# Altium schematic sheet 26D_STEPPER_test.SchDoc
size A4
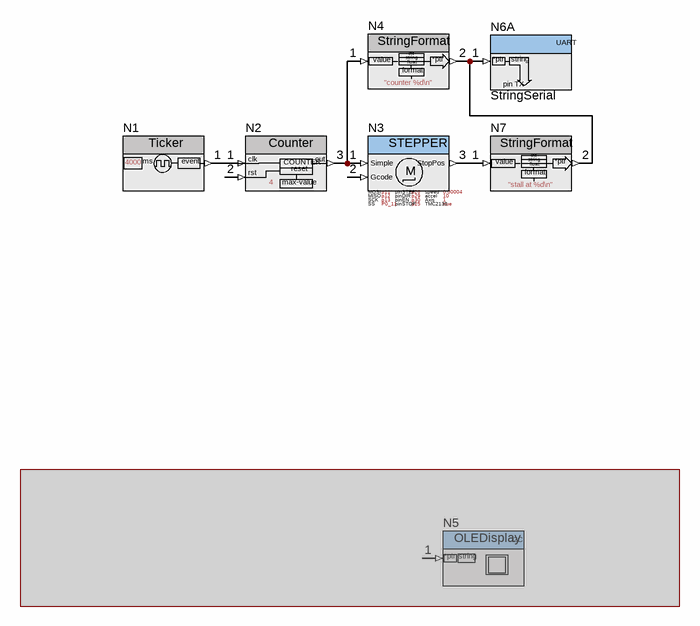
[diagram p0: 26D_STEPPER_test.SchDoc]

## Parts
N1  Ticker  nBlocksParameter1: 4000
N2  Counter  nBlocksParameter1: 4
N3  STEPPER  nBlocksParameter7: p30  nBlocksParameter8: p25  nBlocksParameter9: 0.00004  nBlocksParameter10: 10  nBlocksParameter11: 1  nBlocksParameter12: true  Parameter 12: TMC2130  Parameter 11: Axis  Parameter 10: accel  Parameter 9: speed  Parameter 8: pinSTOP  Parameter 7: pinEN  nBlocksParameter1: p11  nBlocksParameter2: p12  nBlocksParameter3: p13  nBlocksParameter4: P0_11  nBlocksParameter5: p26  nBlocksParameter6: p29  Parameter 6: pinDIR  Parameter 5: pinSTEP  Parameter 2: MISO  Parameter 1: MOSI  Parameter 4: SS  Parameter 3: SCK
N4  StringFormat  nBlocksParameter1: "counter %d\n"
N5  OLEDisplay  (masked out: inside a compile mask, not in the netlist)
N6  StringSerial  (part A of 2)
N7  StringFormat  nBlocksParameter1: "stall at %d\n"

## Nets
NetN1_1: N1.1(OUT) N2.1(COUNT-IN)
NetN2_3: N2.3(OUT) N3.1(Simple) N4.1(IN)
NetN3_3: N3.3(StopPos) N7.1(IN)
NetN4_2: N4.2(OUT) N6.1(TX) N7.2(OUT)

Not connected (* = marked no-connect by the designer): N2 2(RESET); N3 2(Gcode)

## Notes on the sheet
- (in symbol NODE-COUNTER) clk; out; COUNTER; rst; reset; max-value
- (in symbol NODE-OLEDisplay) I2C; *ptr; string
- (in symbol NODE-STEPPER) M
- (in symbol NODE-STRINGFORMAT) int; string; *ptr; value; float; format
- (in symbol NODE-STRINGSERIAL-split, part A) UART; *ptr; string; pin TX
- (in symbol NODE-TICKER) ms; event

## Library data of the parts
N1 = NODE-TICKER: Creates a Periodical Event; ComponentLink1Description: link; ComponentLink1URL: https://github.com/nBlocksStudioNodes/nblocks_ticker
N2 = NODE-COUNTER: # Counter / This node is a Reset-able Counter. It increments a count every time the input is triggered and outputs the count value every time the frame updates. / Returns to zero, when max-value is reached / *  Category: Time / *  HAL: mbed / *  Tested: LPC1768, LPC1U35, STM32F103, STM32L432, STM32F401, nRF52832 / *  Author: Ian Aherne / ## Inputs/Outputs / *  (1) The 1st input is the Counter clock input, increments the counter. / *  (2) The 2nd input Resets the Generator / *  (3)The Output is the actual Counter value. / ## Parameters / *  uint32_t: auto_reset, Maximum Counter Value, when the counter reaches this value auto-resets / ## Example: / [Ticker][Counter][StringFormat][StringSerial] /; Parameter 1: AutoResetValue; ComponentLink1Description: link; ComponentLink1URL: https://github.com/nBlocksStudioNodes/nblocks_counter
N3 = NODE-STEPPER: # STEPPER / Node for simple Stepping Motor Control. Will work with: SilentStepstick, StepStick, or a any Step/Dir driven Step Motor driver; ComponentLink1Description: link; ComponentLink1URL: https://github.com/nBlocksStudioNodes/nblocks_stepper
N4 N7 = NODE-STRINGFORMAT: # StringFormat / Adds Formatting to a number in printf style / *  Category: String / *  HAL: mbed / *  Tested: LPC1768, STM32F103, STM32F401, nRF52832 / *  Author: Fernando Cosentino / ## Inputs/Outputs / *  (1) Input int: Value in form of string, or int or float / *  (2) Output uint32_t: Pointer to array of string, or int, or float / ## Parameters / *  formatString: example "Value: %d\n" / ## Example: / [Ticker][Counter][StringFormat][StringSerial] / Prints / “Value: 0” / “Value: 1” / “Value: 3” / … /; ComponentLink1Description: link; ComponentLink1URL: https://github.com/nBlocksStudioNodes/nblocks_stringformat; Parameter 1: formatString
N5 = NODE-OLEDisplay: # LM75 / This node handles temperature readings from a LM75 sensor over I2C. / *  Category: Sensor / *  HAL: mbed / *  Tested: LPC1768 / *  Author: Fernando Cosentino / ## Inputs/Outputs / *  (1) Trigger: Starts a measurement conversion / *  (2) Celcius:  °C  Temperature in degrees Celcius / ## Parameters / *  PinName: Pin connected to the sensor's SDA line / *  PinName: Pin connected to the sensor's SCL line / *  int: I2C address / *  float: alarmMin, Lower threshold for temperature alarm / *  float: alarmMax, Upper threshold for temperature alarm / *  int: comparatorPolarity, output value for the OS output when active / *  int: scale: Scale Factor / *  Multiplier for temperature value as integer (scale=100 means 2.5C will be represented as 250) / ## Example: / [Ticker]-->[LM75]-->[StringFormat]-->[StringSerial] /; Parameter 2: pinSCL; Parameter 1: pinSDA; Parameter 3: pinRST; nBlocksParameter3: p27; nBlocksParameter2: p10; nBlocksParameter1: p9; ComponentLink1Description: link; ComponentLink1URL: https://github.com/nBlocksStudioNodes/nblocks_oledisplay
N6 = NODE-STRINGSERIAL-split: StringSerial / This node implements a serial port, where characters received from the external world (RX pin) are sent one by one to the node's output, but the node's input expects a full string object as input (sent entirely within one frame to the TX pin). / DO NOT CONNECT integer data into this node, as it will definitely lead to incorrect behaviour, sending random bytes in unpredicted amount to the serial port. This can be harmful depending on your design.; nBlocksParameter2: USBRX; Parameter 2: pinRX; nBlocksParameter1: USBTX; Parameter 1: pinTX; ComponentLink1Description: link; ComponentLink1URL: https://github.com/nBlocksStudioNodes/nblocks_stringserial